# Altium project temperatureSensor.PrjPcb
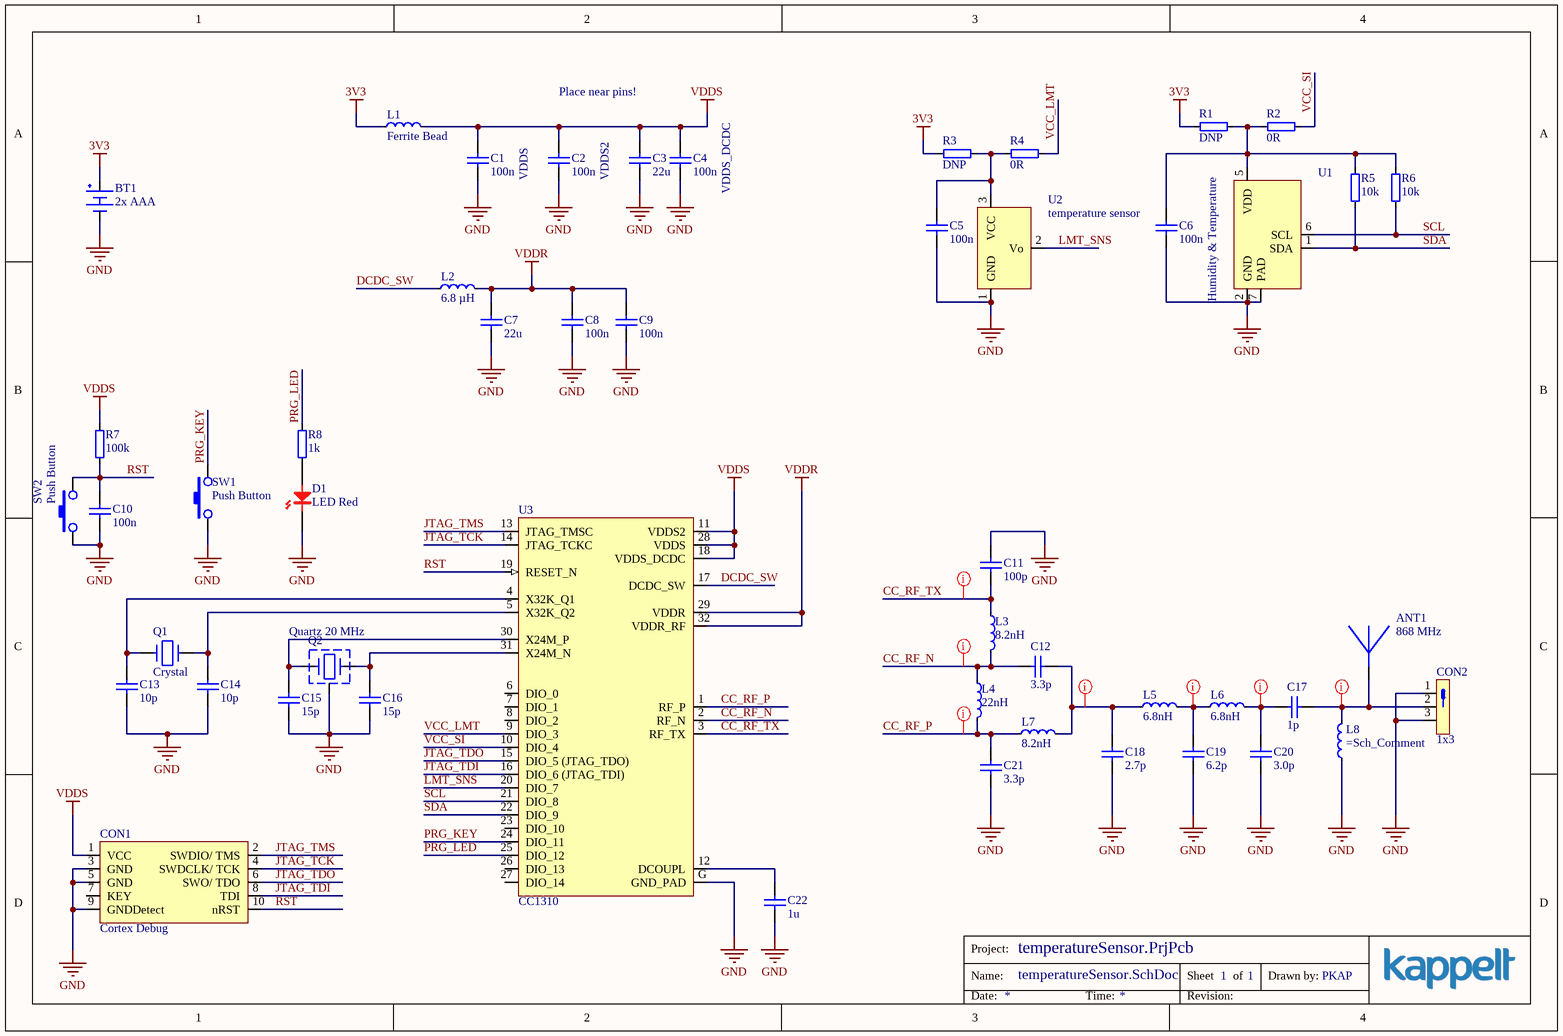
[diagram p0: temperatureSensor.SchDoc]
1 sheet, 50 parts. Net scope: global (net labels, ports and power ports of the same name join across sheets).
Board file: temperatureSensor.PcbDoc

## Sheet temperatureSensor.SchDoc
size A4; DrawnBy: PKAP; SheetNumber: 1; SheetTotal: 1; PageSetup: Record=PageOptions|CenterHorizontal=True|CenterVertical=True|PrintScale=0.97|XCorrection=1.00|YCorrection=1.00|PrintKind=0|BorderSize=5000000|LeftOffset=0|BottomOffset=0|Orientation=2|PaperLength=1000|PaperWidth=1000|Scale=100|PaperSource=7|PrintQuality=-3|MediaType=1|DitherType=10|PrintScaleMode=1|PaperKind=A4|PaperIndex=9

### Parts
ANT1  868 MHz  [Ant-868-Helical]  (no BOM)
BT1  2x AAA  [Keystone-2468]
C1  100n  [0603_N]
C2  100n  [0603_N]
C3  22u  [0805_N]
C4  100n  [0603_N]
C5  100n  [0603_N]
C6  100n  [0603_N]
C7  22u  [0805_N]
C8  100n  [0603_N]
C9  100n  [0603_N]
C10  100n  [0603_N]
C11  100p  [0603_N]
C12  3.3p  [0603_N]
C13  10p  [0603_N]
C14  10p  [0603_N]
C15  15p  [0805_N]
C16  15p  [0805_N]
C17  1p  [0603_N]
C18  2.7p  [0603_N]
C19  6.2p  [0603_N]
C20  3.0p  [0603_N]
C21  3.3p  [0603_N]
C22  1u  [0603_N]
CON1  Cortex Debug  [cortex-dbg]
CON2  1x3  [Header_254_1x3_male]
D1  LED Red  [0805_LED]
L1  Ferrite Bead  [0603_N]
L2  6.8 µH  [0805_N]
L3  8.2nH  [0603_N]
L4  22nH  [0603_N]
L5  6.8nH  [0603_N]
L6  6.8nH  [0603_N]
L7  8.2nH  [0603_N]
L8  (no value)  [0603_N]
Q1  Crystal  [AB38t]
Q2  Quartz 20 MHz  [LFXTAL058124]
R1  DNP  [0603_N]
R2  0R  [0603_N]
R3  DNP  [0603_N]
R4  0R  [0603_N]
R5  10k  [0805_N]
R6  10k  [0805_N]
R7  100k  [0603_N]
R8  1k  [0603_N]
SW1  Push Button  [FSMSM]
SW2  Push Button  [FSMSM]
U1  Humidity & Temperature  [SI7020-DFN6]
U2  temperature sensor  [LMT85-TO92]
U3  CC1310  [CC1310F128RHB-QFN32]

### Nets
3V3: BT1.P(+) L1.1 R1.1 R3.1
GND: BT1.N(-) C1.1 C2.1 C3.1 C4.1 C5.1 C6.1 C7.1 C8.1 C9.1 C10.1 C11.2 C13.1 C14.1 C15.1 C16.1 C18.2 C19.2 C20.2 C21.1 C22.1 CON1.3(GND) CON1.5(GND) CON1.9(GNDDetect) CON2.1 CON2.3 D1.K L8.1 Q2.G(GND) SW1.1(NO1A) SW2.1(NO1A) U1.2(GND) U1.7(PAD) U2.1(GND) U3.G(GND_PAD)
VDDR: C7.2 C8.2 C9.2 L2.2 U3.29(VDDR) U3.32(VDDR_RF)
VDDS: C1.2 C2.2 C3.2 C4.2 CON1.1(VCC) L1.2 R7.1 U3.11(VDDS2) U3.18(VDDS_DCDC) U3.28(VDDS)
CC_RF_N: C12.2 L3.2 L4.1 U3.2(RF_N)
CC_RF_P: C21.2 L4.2 L7.1 U3.1(RF_P)
CC_RF_TX: C11.1 L3.1 U3.3(RF_TX)
DCDC_SW: L2.1 U3.17(DCDC_SW)
JTAG_TCK: CON1.4(SWDCLK/_TCK) U3.14(JTAG_TCKC)
JTAG_TDI: CON1.8(TDI) U3.16(DIO_6_(JTAG_TDI))
JTAG_TDO: CON1.6(SWO/_TDO) U3.15(DIO_5_(JTAG_TDO))
JTAG_TMS: CON1.2(SWDIO/_TMS) U3.13(JTAG_TMSC)
LMT_SNS: U2.2(Vo) U3.20(DIO_7)
PRG_KEY: SW1.2(NO2A) U3.24(DIO_11)
PRG_LED: R8.1 U3.25(DIO_12)
RST: C10.2 CON1.10(nRST) R7.2 SW2.2(NO2A) U3.19(RESET_N)
SCL: R6.2 U1.6(SCL) U3.21(DIO_8)
SDA: R5.2 U1.1(SDA) U3.22(DIO_9)
VCC_LMT: R4.2 U3.9(DIO_3)
VCC_SI: R2.2 U3.10(DIO_4)
NetANT1_1: ANT1.1 C17.1 CON2.2 L8.2
NetC5_2: C5.2 R3.2 R4.1 U2.3(VCC)
NetC6_2: C6.2 R1.2 R2.1 R5.1 R6.1 U1.5(VDD)
NetC12_1: C12.1 C18.1 L5.1 L7.2
NetC13_2: C13.2 Q1.1 U3.4(X32K_Q1)
NetC14_2: C14.2 Q1.2 U3.5(X32K_Q2)
NetC15_2: C15.2 Q2.Q2 U3.30(X24M_P)
NetC16_2: C16.2 Q2.Q1 U3.31(X24M_N)
NetC17_2: C17.2 C20.1 L6.2
NetC19_1: C19.1 L5.2 L6.1
NetC22_2: C22.2 U3.12(DCOUPL)
NetD1_A: D1.A R8.2

Not connected (* = marked no-connect by the designer): CON1 7(KEY); U3 6(DIO_0) 7(DIO_1) 8(DIO_2) 23(DIO_10) 26(DIO_13) 27(DIO_14)

### Layout directives
net class RF: CC_RF_N, CC_RF_P, CC_RF_TX, NetANT1_1, NetC12_1, NetC17_2, NetC19_1

### Notes on the sheet
- Place near pins!
- VDDS
- VDDS2
- (near C4) VDDS_DCDC
- Project:
- Name:
- Sheet
- of
- Drawn by:
- Date:
- Time:
- Revision:

### Library data of the parts
ANT1 = ANT-868-Helical: 868 MHz Helical PCB Antenna, see TI swra416.pdf
BT1 = Battery-AAA-Double: Double AAA Battery Holder; MID: Keystone; PID: 2468; Supplier 1: Mouser; Supplier Part Number 1: 534-2468
C1 C2 C4-C6 C8-C10 = 100n_50V_0603: 100n 50V 0603; part_id: 1100026; MID: std; accuracy: 10.00%; Part Number: 100n_50V_0603; Category: _0603; Sch_Comment: 100n; PID: std; Value: 100n; voltage_rate: 50V; Supplier 1: Mouser; Supplier Part Number 1: 710-885012206071
C3 C7 = 22u_25V_0805: 22u 25V 0805; part_id: 1100136; MID: std; accuracy: 10.00%; Part Number: 22u_25V_0805; Category: _0805; Sch_Comment: 22u; PID: std; Value: 22u; voltage_rate: 25V; Supplier 1: Mouser; Supplier Part Number 1: 81-GRM21BC80G226ME9L
C11 = 100p_50V_0603: 100p 50V 0603; part_id: 1100011; MID: std; accuracy: 10.00%; Part Number: 100p_50V_0603; Category: _0603; Sch_Comment: 100p; PID: std; Value: 100p; voltage_rate: 50V; Supplier 1: Mouser; Supplier Part Number 1: 710-885012206003
C12 C21 = 3p3_50V_0603: 3p3 50V 0603; part_id: 1100003; MID: std; accuracy: 10.00%; Part Number: 3p3_50V_0603; Category: _0603; Sch_Comment: 3.3p; PID: std; Value: 3.3p; voltage_rate: 50V; Supplier 1: Mouser; Supplier Part Number 1: 81-GRM1885C1H3R3CA1D
C13 C14 = 10p_50V_0603: 10p 50V 0603; part_id: 1100006; MID: std; accuracy: 10.00%; Part Number: 10p_50V_0603; Category: _0603; Sch_Comment: 10p; PID: std; Value: 10p; voltage_rate: 50V
C15 C16 = 10p_50V_0805: 15p 50V 0805; Part Number: 15p_50V_0805; accuracy: 10.00%; Category: _0805; Sch_Comment: 15p; Value: 15p; voltage_rate: 50V; Supplier 1: Mouser; Supplier Part Number 1: 710-885012007001
C17 = 100p_50V_0603: 1p 50V 0603; Part Number: 1p_50V_0603; MID: std; accuracy: 10.00%; Category: _0603; Sch_Comment: 1p; PID: std; Value: 1p; voltage_rate: 50V; Supplier 1: Mouser; Supplier Part Number 1: 609-251R14S1R0CV4T
C18 = 3p3_50V_0603: 2p7 50V 0603; Part Number: 2p7_50V_0603; MID: std; accuracy: 10.00%; Category: _0603; Sch_Comment: 2.7p; Value: 2.7p; voltage_rate: 50V; Supplier 1: Mouser; Supplier Part Number 1: 81-GRM1885C1H2R7CA1D
C19 = 3p3_50V_0603: 6p2 50V 0603; Part Number: 6p2_50V_0603; MID: std; accuracy: 10.00%; Category: _0603; Sch_Comment: 6.2p; Value: 6.2p; voltage_rate: 50V; Supplier 1: Mouser; Supplier Part Number 1: 581-06032U6R2BAT2A
C20 = 3p3_50V_0603: 3p 50V 0603; Part Number: 3p_50V_0603; MID: std; accuracy: 10.00%; Category: _0603; Sch_Comment: 3.0p; Value: 3.0p; voltage_rate: 50V; Supplier 1: Mouser; Supplier Part Number 1: 581-06035U3R0B
C22 = 1u_50V_0603: 1u 50V 0603; part_id: 1100031; MID: std; accuracy: 10.00%; Part Number: 1u_50V_0603; Category: _0603; Sch_Comment: 1u; PID: std; Value: 1u; voltage_rate: 50V; Supplier 1: Mouser; Supplier Part Number 1: 710-885012106010
CON1 = Cortex-DBG: MID: Samtec; PID: FTSH-105-01-L-DV-K
CON2 = Header_1x03_male: Male Connector 1x3; part_id: 1201103; MID: std; current_rate: 2A; voltage_rate: 100V; Row Count: 1; Column Count: 3; Pitch: 2.54mm; Part Number: Header_1x03_male; Sch_Comment: 1x3; PID: std; Pin Count: 3
D1 = LED-STD-RED-0805: Standard LED Red 0805; MID: std; PID: std; Supplier 1: Mouser; Supplier Part Number 1: 604-AP2012EC
L1 = Inductor_General_Purpose_0603: MID: Murata; PID: BLM18HE152SN1D; Sch_Comment: Ferrite Bead; Supplier 1: Mouser; Supplier Part Number 1: 81-BLM18HE152SN1D
L2 = Inductor_General_Purpose_0603: Chip Inductor 0805; MID: TDK; PID: MLZ2012N6R8LT000; Sch_Comment: 6.8 µH; Supplier 1: Mouser; Supplier Part Number 1: 810-MLZ2012N6R8L
L3 L7 = Inductor_General_Purpose_0603: 8.2nH Inductor; MID: Murata; PID: LQG15HS8N2J02D; Sch_Comment: 8.2nH; Value: 8.2nH; Supplier 1: Mouser; Supplier Part Number 1: 81-LQG15HS8N2J02D
L4 = Inductor_General_Purpose_0603: 22nH Inductor; MID: Murata; PID: LQG15HS22NJ02D; Sch_Comment: 22nH; VALUE: 22nH; Supplier 1: Mouser; Supplier Part Number 1: 81-LQG15HS22NJ02D
L5 L6 = Inductor_General_Purpose_0603: 6.8H Inductor; MID: Murata; PID: LQG15HS6N8J02D; Sch_Comment: 6.8nH; Supplier 1: Mouser; Supplier Part Number 1: 81-LQG15HS6N8J02D
  L5: Value: 6.8nH
  L6: VALUE: 6.8nH
L8 = Inductor_General_Purpose_0603: Inductor for PCB Antenna compensation; MID: TBD; Sch_Comment: 12nH; Value: 12nH; PID: TBD; Supplier 1: Mouser; Supplier Part Number 1: 609-L-14C12NJV4T
Q1 = AB38T-32.768KHZ: MID: Abracon; PID: AB38T-32.768KHZ; Supplier 1: Mouser; Supplier Part Number 1: 449-LFXTAL002996BULK
Q2 = LFXTAL058124: Standard 3.2 x 2.5mm SMD crystal in a ceramic package with a  seam sealed metal lid, hermetically sealed.; MID: IQD Frequency Products; PID: LFXTAL058124; Supplier 1: Mouser; Supplier Part Number 1: 449-LFXTAL058124REEL
R1 R3 = 0R_100mW_0603: 0R 100mW 0603; part_id: 1000001; voltage_rate: 50V; accuracy: 5.00%; Part Number: 0R_100mW_0603; Category: _0603; Sch_Comment: DNP; Value: DNP; power_rate: 100mW
R2 R4 = 0R_100mW_0603: 0R 100mW 0603; part_id: 1000001; MID: std; voltage_rate: 50V; accuracy: 5.00%; Part Number: 0R_100mW_0603; Category: _0603; Sch_Comment: 0R; PID: std; Value: 0R; power_rate: 100mW
R5 R6 = 10k_125mW_0805: 10k 125mW 0805; part_id: 1000150; MID: std; voltage_rate: 50V; accuracy: 5.00%; Part Number: 10k_125mW_0805; Category: _0805; Sch_Comment: 10k; PID: std; Value: 10k; power_rate: 125mW; Supplier 1: Mouser; Supplier Part Number 1: 588-AS08J1002ET
R7 = 100k_100mW_0603: 100k 100mW 0603; part_id: 1000062; MID: std; voltage_rate: 50V; accuracy: 5.00%; Part Number: 100k_100mW_0603; Category: _0603; Sch_Comment: 100k; PID: std; Value: 100k; power_rate: 100mW; Supplier 1: Mouser; Supplier Part Number 1: 71-RCA0603100KJNEC
R8 = 1k_100mW_0603: 1k 100mW 0603; part_id: 1000038; MID: std; voltage_rate: 50V; accuracy: 5.00%; Part Number: 1k_100mW_0603; Category: _0603; Sch_Comment: 1k; PID: std; Value: 1k; power_rate: 100mW; Supplier 1: Mouser; Supplier Part Number 1: 71-CRCW0603-1.0K-E3
SW1 SW2 = Switch-FSMSM: Taster, Nicht beleuchtet, 24 V, 50 mA, 180 gf, Baureihe FSMSM, AlcoSwitch; MID: TE Connectivity; PID: FSMSM; Farnell_ID: 1703878; Supplier 1: Mouser; Supplier Part Number 1: 506-FSMSM
U1 = SI7020: I2C HUMIDITY AND TEMPERATURE SENSOR; MID: Silicon Labs; PID: SI7020; Supplier 1: Mouser; Supplier Part Number 1: 634-SI7020-A20-GMR
U2 = LMT85-TO92: Analog Temperature Sensors with Class-AB Output; MID: Texas Instruments; PID: LMT85LP
U3 = CC1310F128RHB: CC1310 SimpleLink™ Ultra-Low-Power Sub-1 GHz Wireless MCU; MID: Texas Instruments; PID: CC1310F128RHB/ CC1310F64RHB/ CC1310F32RHB (different flash sizes); Supplier 1: Mouser; Supplier Part Number 1: 595-CC1310F32RHBT

## Assembly variants
batch_one: not fitted C5 C13 C14 Q1 R1 R3 R4 SW2 U2